# Altium schematic sheet 05_01_Basic_Gates.SchDoc
size 111 x 66 mm
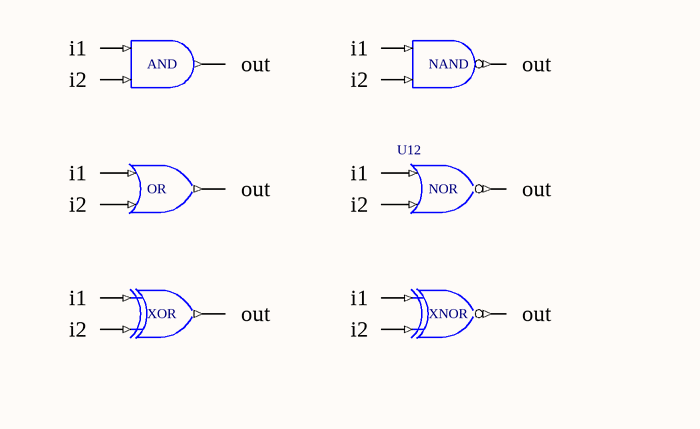
[diagram p0: 05_01_Basic_Gates.SchDoc]

## Parts
U9  AND
U10  NAND
U11  OR
U12  NOR
U13  XOR
U14  XNOR

## Nets
GND: U13.7(GND)
VDD: U13.14(VDD)

Not connected (* = marked no-connect by the designer): U9 A B Y; U10 A B Y; U11 A B Y; U12 A B Y; U13 1(A) 2(B) 3(Y); U14 1(A) 2(B) 3(Y)

## Notes on the sheet
- (near U9) i1
- (near U9) out
- (near U10) i1
- (near U10) out
- (near U9) i2
- (near U10) i2
- (near U11) i1
- (near U11) i2
- (near U11) out
- (near U12) i1
- (near U12) i2
- (near U12) out
- (near U13) i1
- (near U14) i1
- (near U13) i2
- (near U13) out
- (near U14) i2
- (near U14) out

## Library data of the parts
U9 U10 = AND: 2 Input AND
U11 U12 = OR: 2 Input OR
U14 = XOR